# Altium schematic sheet mainboard_interface.v1.1.SchDoc
size A4
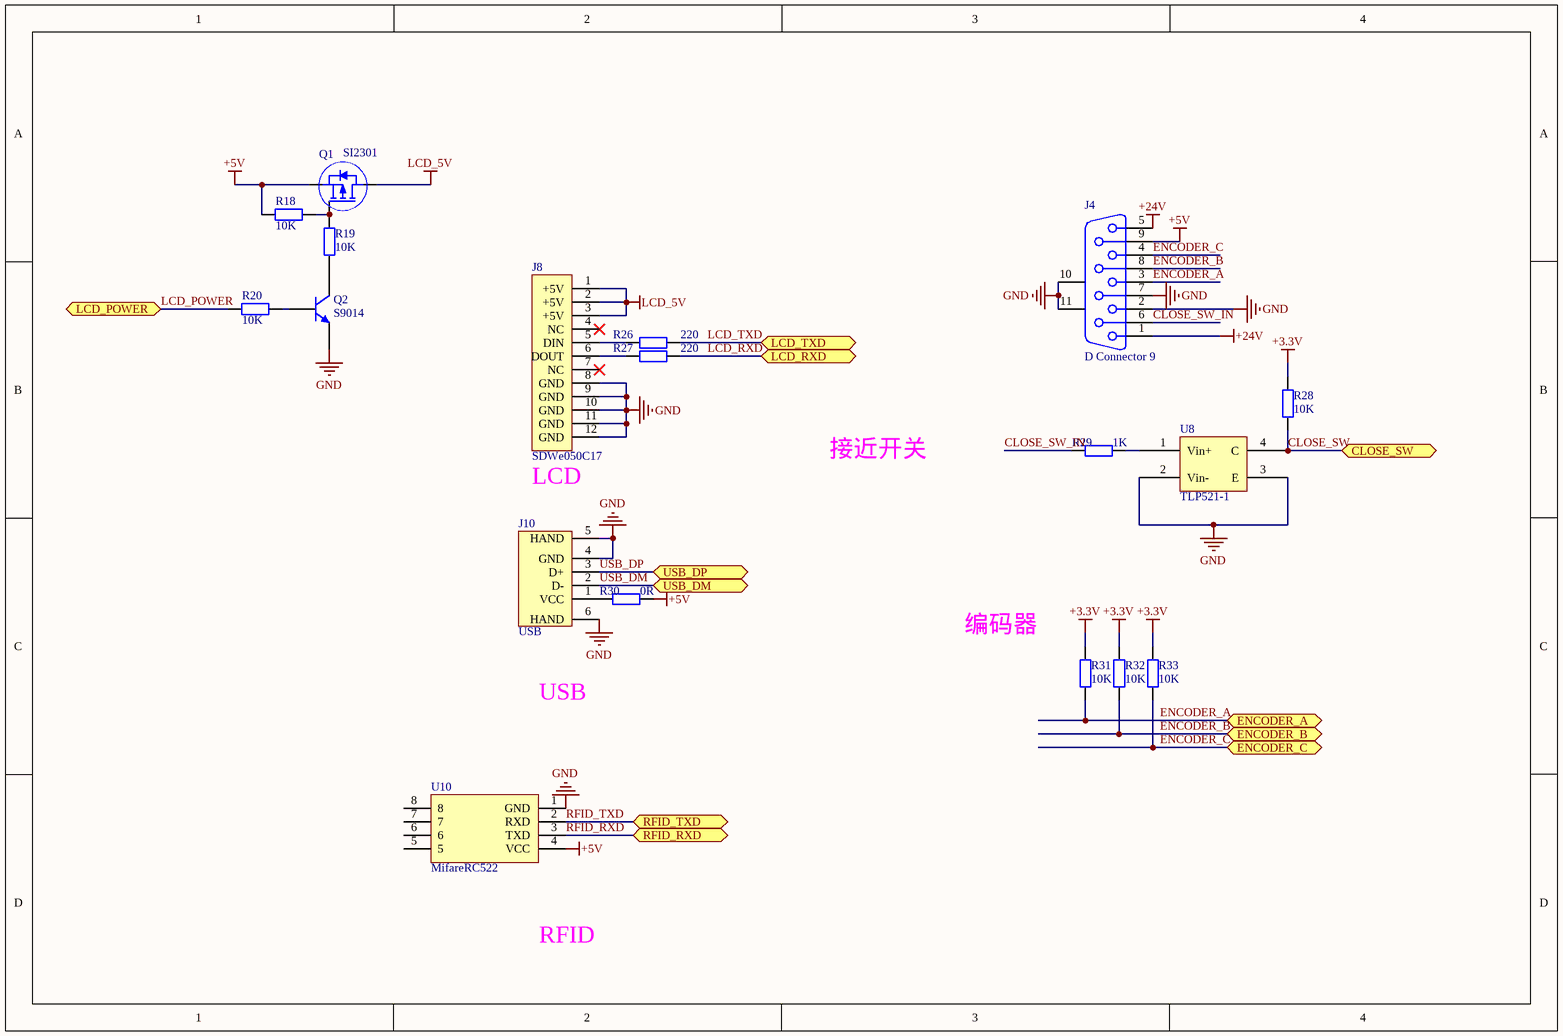
[diagram p0: mainboard_interface.v1.1.SchDoc]

## Parts
J4  D Connector 9  [DSUB1.385-2H9]
J8  SDWe050C17  [FCC1.0-10]
J10  USB  [USB_FEMALE_A]
Q1  SI2301  [MOS-N_SOT-23]
Q2  S9014  [901X_SOT-23]
R18  10K  [0805]
R19  10K  [0805]
R20  10K  [0805]
R26  220  [0805]
R27  220  [0805]
R28  10K  [0805]
R29  1K  [0805]
R30  0R  [0805]
R31  10K  [0805]
R32  10K  [0805]
R33  10K  [0805]
U8  TLP521-1  [DIP-4]
U10  MifareRC522  [MifareRC522]

## Ports
CLOSE_SW, ENCODER_A, ENCODER_B, ENCODER_C, LCD_POWER, LCD_RXD, LCD_TXD, RFID_RXD, RFID_TXD, USB_DM, USB_DP

## Nets
+3.3V: R28.1 R31.1 R32.1 R33.1
+5V: J4.9 Q1.S R18.1 R30.1 U10.4(VCC)
+24V: J4.1 J4.5
GND: J4.2 J4.7 J4.10(MH1) J4.11(MH2) J8.8(GND) J8.9(GND) J8.10(GND) J8.11(GND) J8.12(GND) J10.4(GND) J10.5(HAND) J10.6(HAND) Q2.3(E) U8.2(Vin-) U8.3(E) U10.1(GND)
LCD_5V: J8.1(+5V) J8.2(+5V) J8.3(+5V) Q1.D
CLOSE_SW: R28.2 U8.4(C) ; port CLOSE_SW
CLOSE_SW_IN: J4.6 R29.2
ENCODER_A: J4.3 R31.2 ; port ENCODER_A
ENCODER_B: J4.8 R32.2 ; port ENCODER_B
ENCODER_C: J4.4 R33.2 ; port ENCODER_C
LCD_POWER: R20.1 ; port LCD_POWER
LCD_RXD: R27.2 ; port LCD_RXD
LCD_TXD: R26.2 ; port LCD_TXD
RFID_RXD: U10.3(TXD) ; port RFID_RXD
RFID_TXD: U10.2(RXD) ; port RFID_TXD
USB_DM: J10.2(D-) ; port USB_DM
USB_DP: J10.3(D+) ; port USB_DP
NetJ8_5: J8.5(DIN) R26.1
NetJ8_6: J8.6(DOUT) R27.1
NetJ10_1: J10.1(VCC) R30.2
NetQ1_G: Q1.G R18.2 R19.2
NetQ2_1: Q2.1(C) R19.1
NetQ2_2: Q2.2(B) R20.2
NetR29_1: R29.1 U8.1(Vin+)

Not connected (* = marked no-connect by the designer): J8 4(NC)* 7(NC)*; U10 5 6 7 8

## Notes on the sheet
- (near J8) LCD
- 接近开关
- 编码器
- USB
- RFID

## Library data of the parts
J4 = D Connector 9: Receptacle Assembly, 9 Position, Right Angle; PackageDocument: O; Positions: 9; Published: 15-Jun-2001; LatestRevisionDate: 17-Jul-2002; LatestRevisionNote: Re-released for DXP Platform.; DatasheetDocument: 1-Sep-1999; PackageReference: 788750; Publisher: Altium Limited; Orientation: Right Angle; Gender: Receptacle
J8 = SH-12
Q1 = MOS-P_SOT-23
Q2 = NPN
R18-R20 R26-R28 R30-R33 = Res2: Resistor; Value: 1K; Published: 8-Jun-2000; LatestRevisionDate: 17-Jul-2002; LatestRevisionNote: Re-released for DXP Platform.; PackageReference: AXIAL-0.4; Publisher: Altium Limited
R29 = Res2: Resistor; Published: 8-Jun-2000; LatestRevisionDate: 17-Jul-2002; LatestRevisionNote: Re-released for DXP Platform.; PackageReference: AXIAL-0.4; Publisher: Altium Limited; Value: 1K